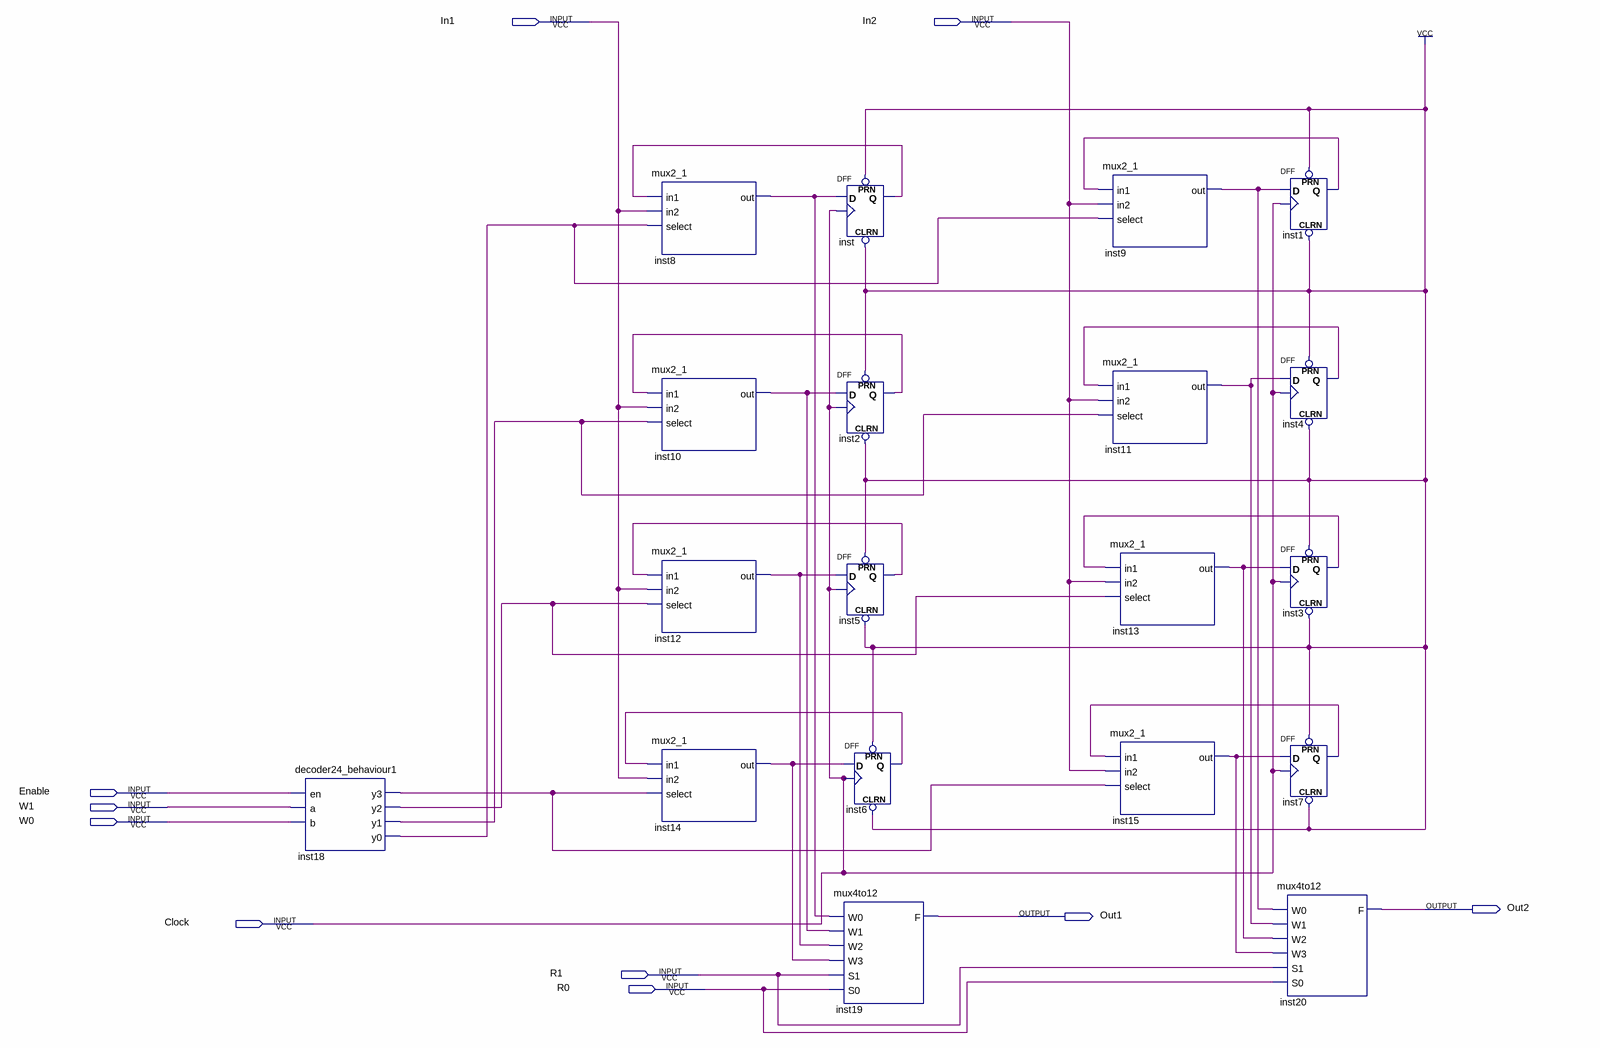
[diagram p0: schematic sheet]
// Quartus schematic regFile.bdf as structural Verilog: 19 symbols, 10 pins
module regFile (
  input  In1,
  input  In2,
  input  Enable,
  input  W1,
  input  W0,
  input  Clock,
  input  R1,
  input  R0,
  output Out2,
  output Out1
);

  wire inst1_q, inst2_q, inst3_q, inst4_q, inst5_q, inst6_q, inst7_q, inst8_out, inst9_out, inst10_out,
       inst11_out, inst12_out, inst13_out, inst14_out, inst15_out, inst18_y0, inst18_y1, inst18_y2,
       inst18_y3, inst_q;

  decoder24_behaviour1 inst18 (
    .en(Enable), .a(W1), .b(W0), .y3(inst18_y3), .y2(inst18_y2), .y1(inst18_y1), .y0(inst18_y0));
  mux2_1 inst8 (.in1(inst_q), .in2(In1), .select(inst18_y0), .out(inst8_out));
  mux2_1 inst10 (.in1(inst2_q), .in2(In1), .select(inst18_y1), .out(inst10_out));
  mux2_1 inst12 (.in1(inst5_q), .in2(In1), .select(inst18_y2), .out(inst12_out));
  mux2_1 inst14 (.in1(inst6_q), .in2(In1), .select(inst18_y3), .out(inst14_out));
  DFF inst (.CLRN(1'b1), .CLK(Clock), .D(inst8_out), .PRN(1'b1), .Q(inst_q));
  DFF inst2 (.CLRN(1'b1), .CLK(Clock), .D(inst10_out), .PRN(1'b1), .Q(inst2_q));
  DFF inst5 (.CLRN(1'b1), .CLK(Clock), .D(inst12_out), .PRN(1'b1), .Q(inst5_q));
  mux4to12 inst19 (.W0(inst8_out), .W1(inst10_out), .W2(inst12_out), .W3(inst14_out), .S1(R1), .S0(R0), .F(Out1));
  DFF inst6 (.CLRN(1'b1), .CLK(Clock), .D(inst14_out), .PRN(1'b1), .Q(inst6_q));
  mux2_1 inst9 (.in1(inst1_q), .in2(In2), .select(inst18_y0), .out(inst9_out));
  mux2_1 inst11 (.in1(inst4_q), .in2(In2), .select(inst18_y1), .out(inst11_out));
  mux2_1 inst13 (.in1(inst3_q), .in2(In2), .select(inst18_y2), .out(inst13_out));
  mux2_1 inst15 (.in1(inst7_q), .in2(In2), .select(inst18_y3), .out(inst15_out));
  DFF inst1 (.CLRN(1'b1), .CLK(Clock), .D(inst9_out), .PRN(1'b1), .Q(inst1_q));
  DFF inst4 (.CLRN(1'b1), .CLK(Clock), .D(inst11_out), .PRN(1'b1), .Q(inst4_q));
  DFF inst3 (.CLRN(1'b1), .CLK(Clock), .D(inst13_out), .PRN(1'b1), .Q(inst3_q));
  DFF inst7 (.CLRN(1'b1), .CLK(Clock), .D(inst15_out), .PRN(1'b1), .Q(inst7_q));
  mux4to12 inst20 (.W0(inst9_out), .W1(inst11_out), .W2(inst13_out), .W3(inst15_out), .S1(R1), .S0(R0), .F(Out2));
endmodule
